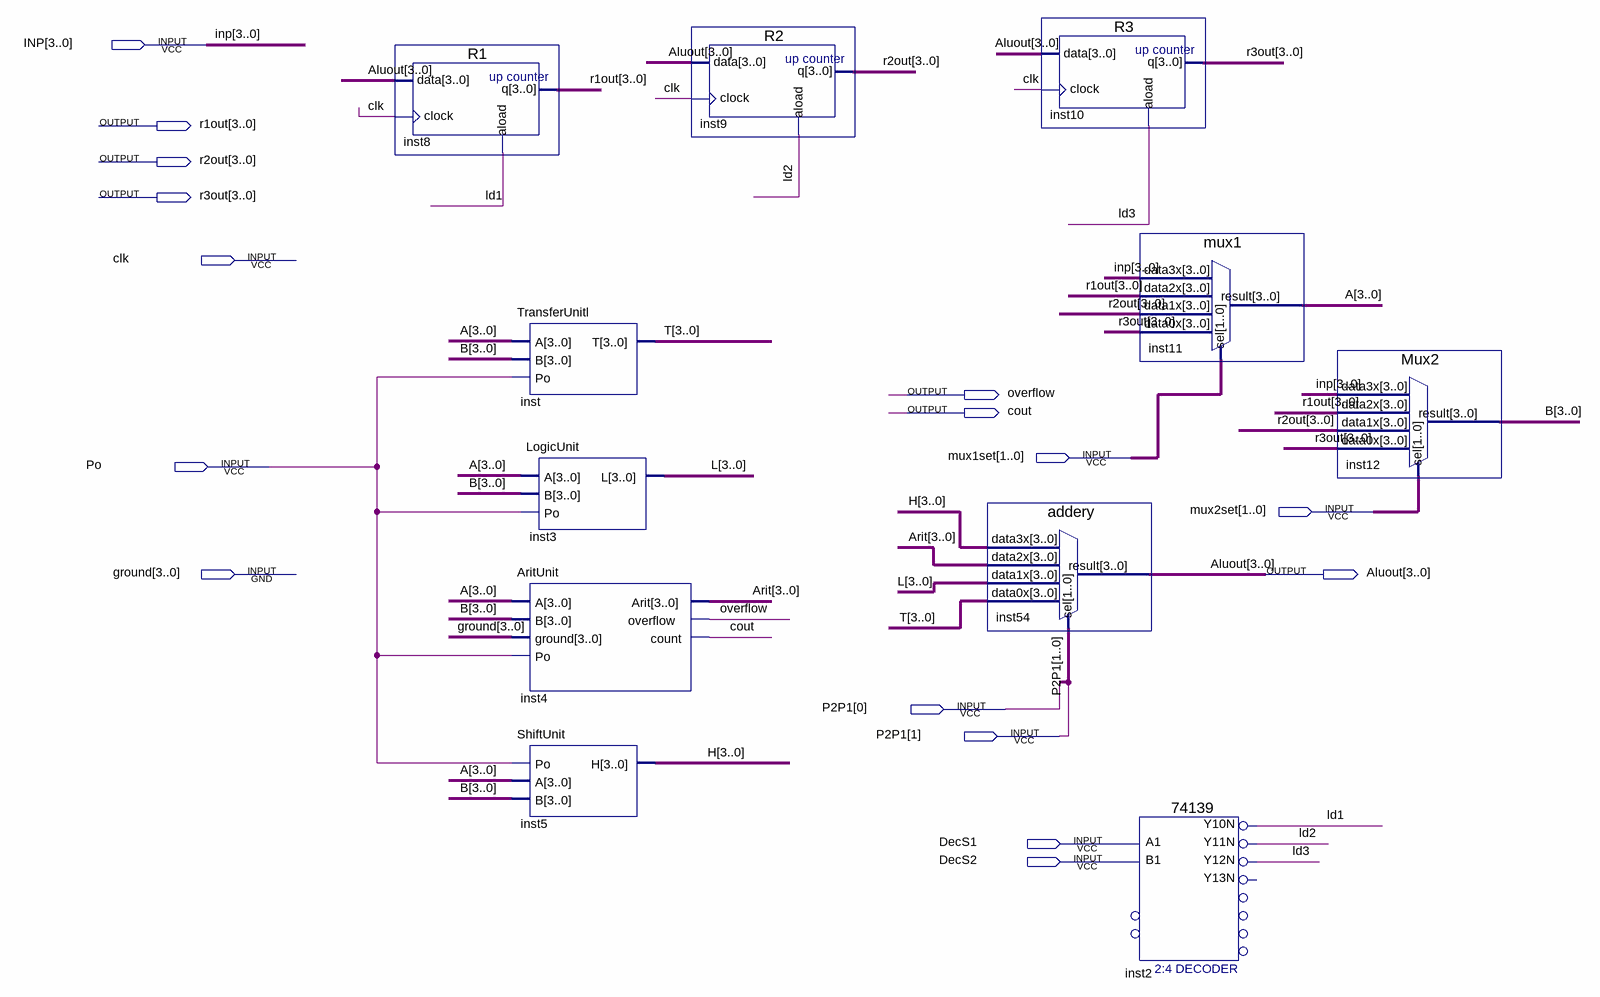
[diagram p0: schematic sheet]
// Quartus schematic AluFinal.bdf as structural Verilog: 11 symbols, 16 pins
module AluFinal (
  input  [3:0] INP,
  input  clk,
  input  [1:0] mux1set,
  input  Po,
  input  [1:0] mux2set,
  input  [3:0] ground,
  input  [1:0] P2P1,
  input  DecS1,
  input  DecS2,
  output [3:0] r1out,
  output [3:0] r2out,
  output [3:0] r3out,
  output overflow,
  output cout,
  output [3:0] Aluout
);

  wire ld1, ld2, ld3;
  wire [3:0] A, Arit, B, H, L, T;

  R1 inst8 (.data(Aluout), .clock(clk), .aload(ld1), .q(r1out));
  TransferUnitl inst (.A(A), .B(B), .Po(Po), .T(T));
  LogicUnit inst3 (.A(A), .B(B), .Po(Po), .L(L));
  AritUnit inst4 (.A(A), .B(B), .ground(ground), .Po(Po), .Arit(Arit), .overflow(overflow), .count(cout));
  ShiftUnit inst5 (.Po(Po), .A(A), .B(B), .H(H));
  R2 inst9 (.data(Aluout), .clock(clk), .aload(ld2), .q(r2out));
  addery inst54 (.data3x(H), .data2x(Arit), .data1x(L), .data0x(T), .sel(P2P1), .result(Aluout));
  R3 inst10 (.data(Aluout), .clock(clk), .aload(ld3), .q(r3out));
  mux1 inst11 (.data3x(INP), .data2x(r1out), .data1x(r2out), .data0x(r3out), .sel(mux1set), .result(A));
  \74139  inst2 (.A1(DecS1), .B1(DecS2), .Y10N(ld1), .Y11N(ld2), .Y12N(ld3));  // open: Y13N
  Mux2 inst12 (.data3x(INP), .data2x(r1out), .data1x(r2out), .data0x(r3out), .sel(mux2set), .result(B));
endmodule
